# Altium schematic sheet Gate_Driver.SchDoc
size A2
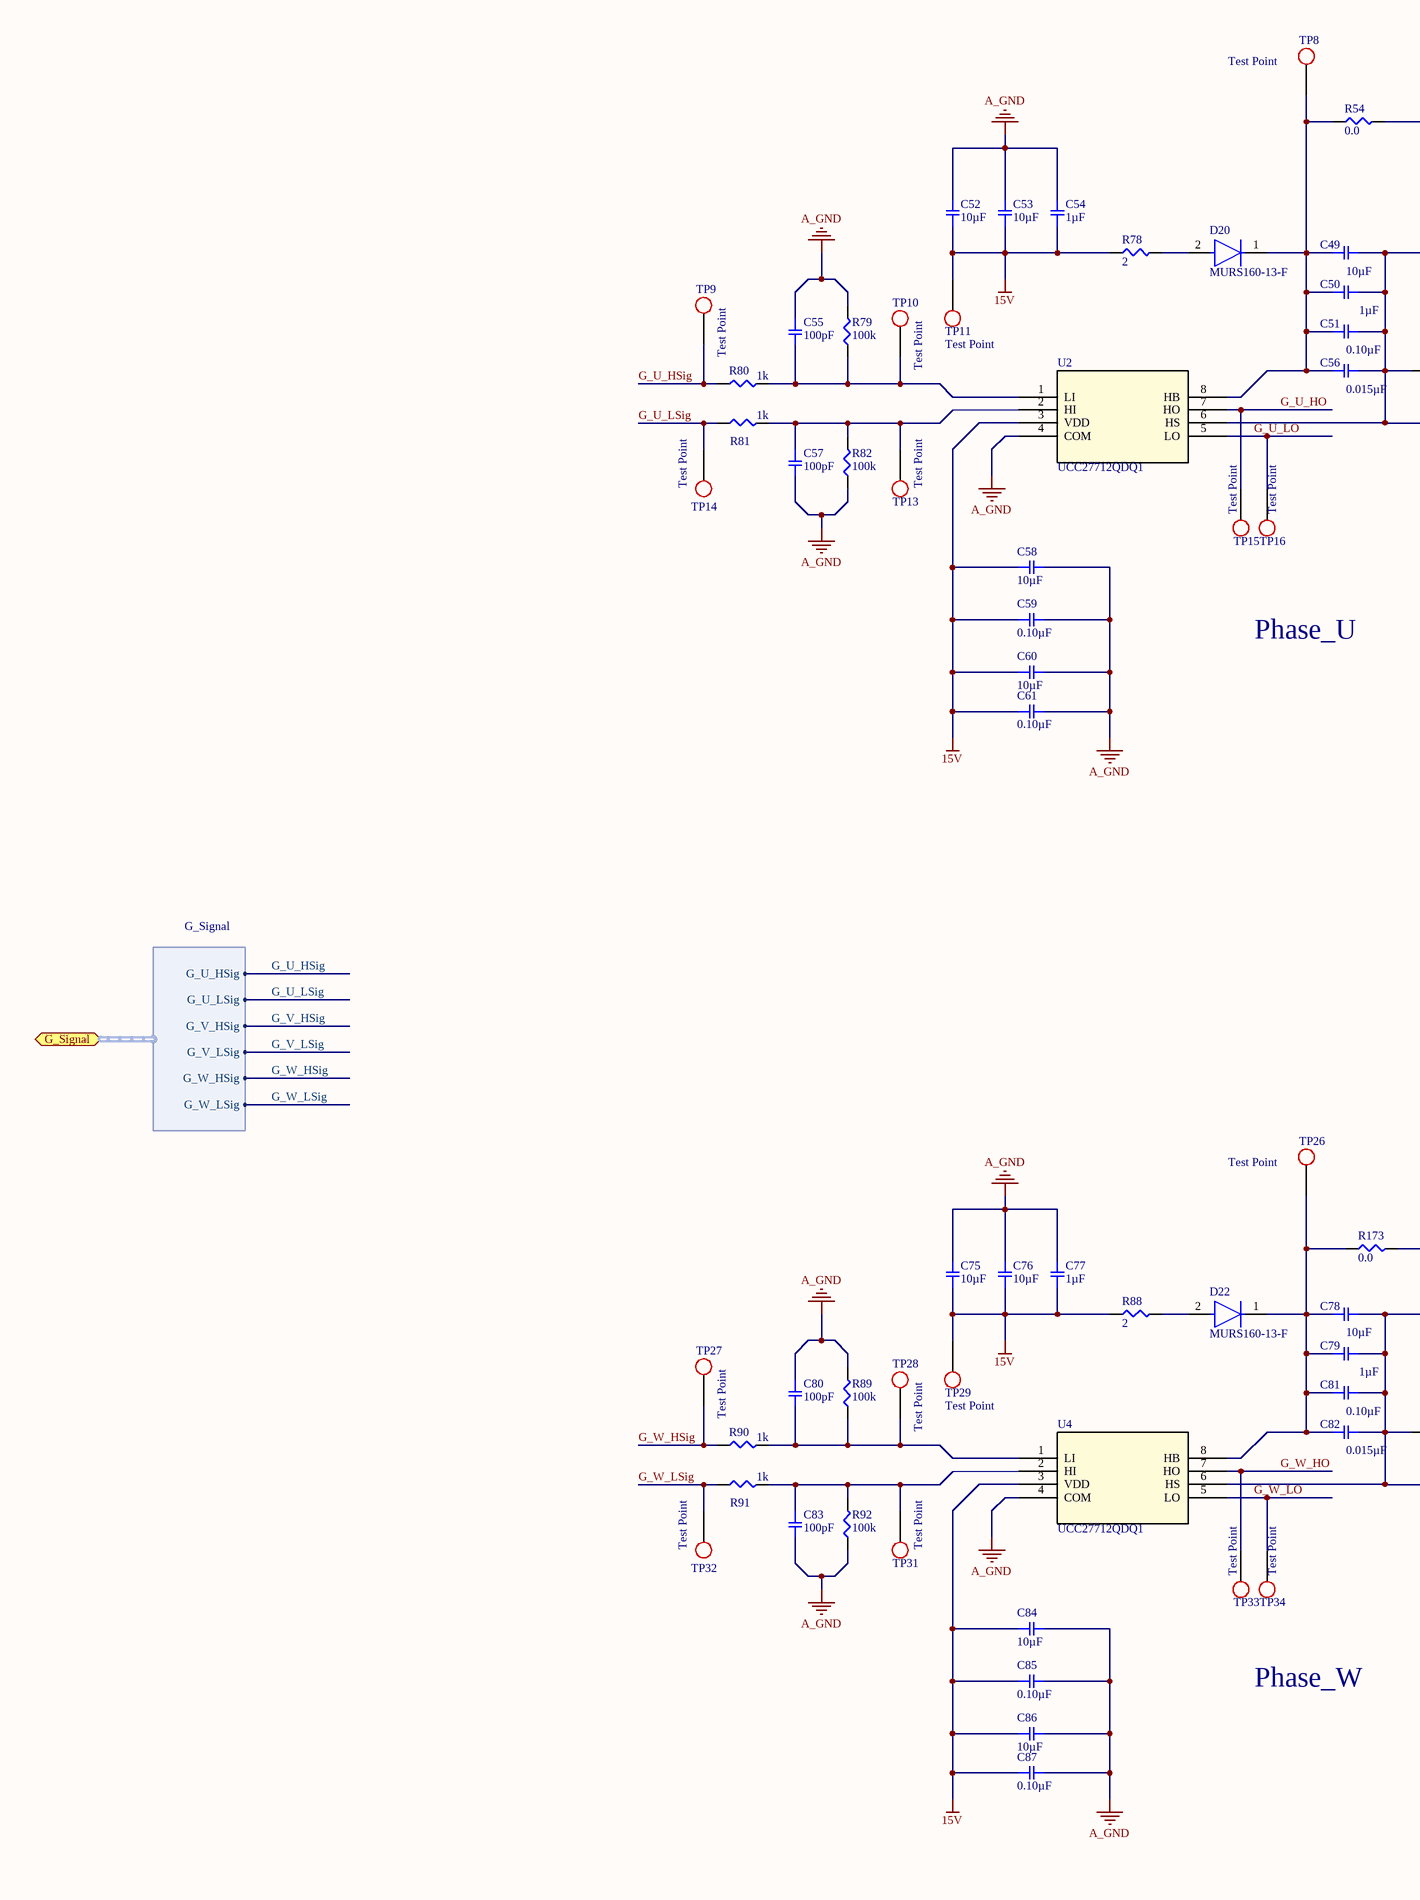
[diagram p0: Gate_Driver.SchDoc, left]
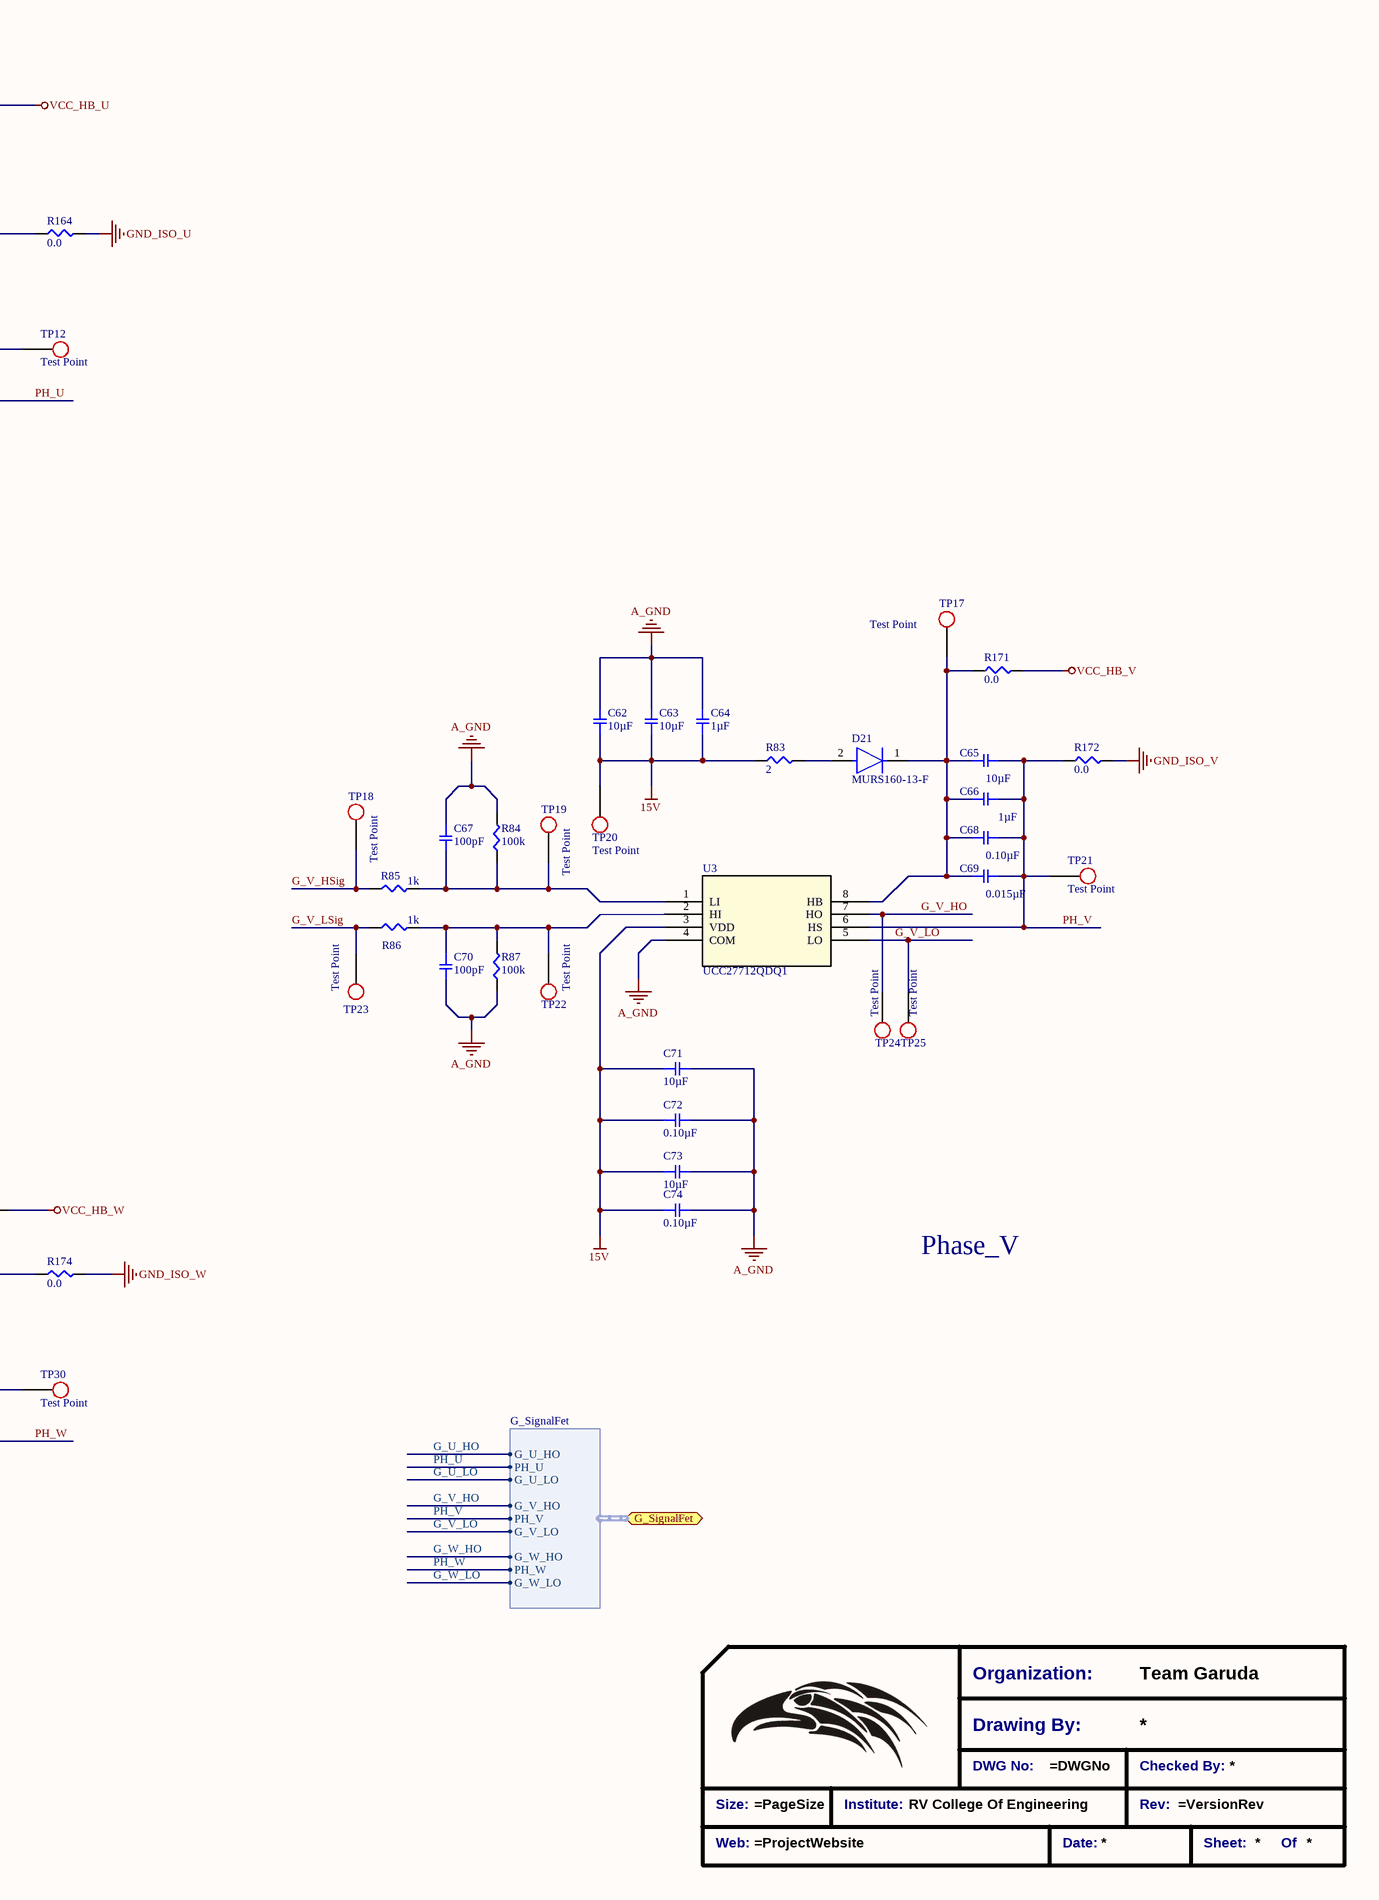
[diagram p1: Gate_Driver.SchDoc, right]

## Parts
*?  Title_Block  (value not drawn)  (graphical)
C49  10µF  [SMD-1206C]
C50  1µF  [SMD-0805C]
C51  0.10µF  [SMD-0805C]
C52  10µF  [SMD-1206C]
C53  10µF  [SMD-1206C]
C54  1µF  [SMD-0805C]
C55  100pF  [SMD-0805C]
C56  0.015µF  [SMD-0603C]
C57  100pF  [SMD-0805C]
C58  10µF  [SMD-1206C]
C59  0.10µF  [SMD-0805C]
C60  10µF  [SMD-1206C]
C61  0.10µF  [SMD-0805C]
C62  10µF  [SMD-1206C]
C63  10µF  [SMD-1206C]
C64  1µF  [SMD-0805C]
C65  10µF  [SMD-1206C]
C66  1µF  [SMD-0805C]
C67  100pF  [SMD-0805C]
C68  0.10µF  [SMD-0805C]
C69  0.015µF  [SMD-0603C]
C70  100pF  [SMD-0805C]
C71  10µF  [SMD-1206C]
C72  0.10µF  [SMD-0805C]
C73  10µF  [SMD-1206C]
C74  0.10µF  [SMD-0805C]
C75  10µF  [SMD-1206C]
C76  10µF  [SMD-1206C]
C77  1µF  [SMD-0805C]
C78  10µF  [SMD-1206C]
C79  1µF  [SMD-0805C]
C80  100pF  [SMD-0805C]
C81  0.10µF  [SMD-0805C]
C82  0.015µF  [SMD-0603C]
C83  100pF  [SMD-0805C]
C84  10µF  [SMD-1206C]
C85  0.10µF  [SMD-0805C]
C86  10µF  [SMD-1206C]
C87  0.10µF  [SMD-0805C]
D20  MURS160-13-F  [FP-SMB-MFG]
D21  MURS160-13-F  [FP-SMB-MFG]
D22  MURS160-13-F  [FP-SMB-MFG]
R54  0.0  [SMD-0805-RES]
R78  2  [SMD-0805-RES]
R79  100k  [SMD-0805-RES]
R80  1k  [SMD-0805-RES]
R81  1k  [SMD-0805-RES]
R82  100k  [SMD-0805-RES]
R83  2  [SMD-0805-RES]
R84  100k  [SMD-0805-RES]
R85  1k  [SMD-0805-RES]
R86  1k  [SMD-0805-RES]
R87  100k  [SMD-0805-RES]
R88  2  [SMD-0805-RES]
R89  100k  [SMD-0805-RES]
R90  1k  [SMD-0805-RES]
R91  1k  [SMD-0805-RES]
R92  100k  [SMD-0805-RES]
R164  0.0  [SMD-0805-RES]
R171  0.0  [SMD-0805-RES]
R172  0.0  [SMD-0805-RES]
R173  0.0  [SMD-0805-RES]
R174  0.0  [SMD-0805-RES]
TP8  Test Point  [Test_point_THT]  (no BOM)
TP9  Test Point  [Test_point_SMD]  (no BOM)
TP10  Test Point  [Test_point_SMD]  (no BOM)
TP11  Test Point  [Test_point_THT]  (no BOM)
TP12  Test Point  [Test_point_THT]  (no BOM)
TP13  Test Point  [Test_point_SMD]  (no BOM)
TP14  Test Point  [Test_point_SMD]  (no BOM)
TP15  Test Point  [Test_point_SMD]  (no BOM)
TP16  Test Point  [Test_point_SMD]  (no BOM)
TP17  Test Point  [Test_point_THT]  (no BOM)
TP18  Test Point  [Test_point_SMD]  (no BOM)
TP19  Test Point  [Test_point_SMD]  (no BOM)
TP20  Test Point  [Test_point_THT]  (no BOM)
TP21  Test Point  [Test_point_THT]  (no BOM)
TP22  Test Point  [Test_point_SMD]  (no BOM)
TP23  Test Point  [Test_point_SMD]  (no BOM)
TP24  Test Point  [Test_point_SMD]  (no BOM)
TP25  Test Point  [Test_point_SMD]  (no BOM)
TP26  Test Point  [Test_point_THT]  (no BOM)
TP27  Test Point  [Test_point_SMD]  (no BOM)
TP28  Test Point  [Test_point_SMD]  (no BOM)
TP29  Test Point  [Test_point_THT]  (no BOM)
TP30  Test Point  [Test_point_THT]  (no BOM)
TP31  Test Point  [Test_point_SMD]  (no BOM)
TP32  Test Point  [Test_point_SMD]  (no BOM)
TP33  Test Point  [Test_point_SMD]  (no BOM)
TP34  Test Point  [Test_point_SMD]  (no BOM)
U2  UCC27712QDQ1  [SOIC127P570X175_HS-9N]
U3  UCC27712QDQ1  [SOIC127P570X175_HS-9N]
U4  UCC27712QDQ1  [SOIC127P570X175_HS-9N]

## Ports
G_Signal (bidir, harness G_Signal), G_SignalFet (bidir, harness G_SignalFet)

## Harnesses
G_Signal: G_U_HSig, G_U_LSig, G_V_HSig, G_V_LSig, G_W_HSig, G_W_LSig
G_SignalFet: G_V_HO, PH_V, G_V_LO, PH_W, G_U_HO, PH_U, G_U_LO, G_W_HO, G_W_LO

## Nets
15V: C52.1 C53.1 C54.1 C58.1 C59.1 C60.1 C61.1 C62.1 C63.1 C64.1 C71.1 C72.1 C73.1 C74.1 C75.1 C76.1 C77.1 C84.1 C85.1 C86.1 C87.1 R78.1 R83.1 R88.1 TP11.1 TP20.1 TP29.1 U2.3(VDD) U3.3(VDD) U4.3(VDD)
A_GND: C52.2 C53.2 C54.2 C55.1 C57.2 C58.2 C59.2 C60.2 C61.2 C62.2 C63.2 C64.2 C67.1 C70.2 C71.2 C72.2 C73.2 C74.2 C75.2 C76.2 C77.2 C80.1 C83.2 C84.2 C85.2 C86.2 C87.2 R79.2 R82.1 R84.2 R87.1 R89.2 R92.1 U2.4(COM) U3.4(COM) U4.4(COM)
GND_ISO_U: R164.2
GND_ISO_V: R172.2
GND_ISO_W: R174.2
VCC_HB_U: R54.2
VCC_HB_V: R171.2
VCC_HB_W: R173.2
G_U_HO: TP15.1 U2.7(HO) ; port G_SignalFet.G_U_HO
G_U_HSig: R80.1 TP9.1 ; port G_Signal.G_U_HSig
G_U_LO: TP16.1 U2.5(LO) ; port G_SignalFet.G_U_LO
G_U_LSig: R81.1 TP14.1 ; port G_Signal.G_U_LSig
G_V_HO: TP24.1 U3.7(HO) ; port G_SignalFet.G_V_HO
G_V_HSig: R85.1 TP18.1 ; port G_Signal.G_V_HSig
G_V_LO: TP25.1 U3.5(LO) ; port G_SignalFet.G_V_LO
G_V_LSig: R86.1 TP23.1 ; port G_Signal.G_V_LSig
G_W_HO: TP33.1 U4.7(HO) ; port G_SignalFet.G_W_HO
G_W_HSig: R90.1 TP27.1 ; port G_Signal.G_W_HSig
G_W_LO: TP34.1 U4.5(LO) ; port G_SignalFet.G_W_LO
G_W_LSig: R91.1 TP32.1 ; port G_Signal.G_W_LSig
PH_U: C49.2 C50.2 C51.2 C56.2 R164.1 TP12.1 U2.6(HS) ; port G_SignalFet.PH_U
PH_V: C65.2 C66.2 C68.2 C69.2 R172.1 TP21.1 U3.6(HS) ; port G_SignalFet.PH_V
PH_W: C78.2 C79.2 C81.2 C82.2 R174.1 TP30.1 U4.6(HS) ; port G_SignalFet.PH_W
NetC49_1: C49.1 C50.1 C51.1 C56.1 D20.1(C) R54.1 TP8.1 U2.8(HB)
NetC55_2: C55.2 R79.1 R80.2 TP10.1 U2.1(LI)
NetC57_1: C57.1 R81.2 R82.2 TP13.1 U2.2(HI)
NetC65_1: C65.1 C66.1 C68.1 C69.1 D21.1(C) R171.1 TP17.1 U3.8(HB)
NetC67_2: C67.2 R84.1 R85.2 TP19.1 U3.1(LI)
NetC70_1: C70.1 R86.2 R87.2 TP22.1 U3.2(HI)
NetC78_1: C78.1 C79.1 C81.1 C82.1 D22.1(C) R173.1 TP26.1 U4.8(HB)
NetC80_2: C80.2 R89.1 R90.2 TP28.1 U4.1(LI)
NetC83_1: C83.1 R91.2 R92.2 TP31.1 U4.2(HI)
NetD20_2: D20.2(A) R78.2
NetD21_2: D21.2(A) R83.2
NetD22_2: D22.2(A) R88.2

## Notes on the sheet
- Phase_U
- Phase_V
- Phase_W
- (in symbol Title_Block) Organization:; Team Garuda; Drawing By:; DWG No:; Checked By:; Size:; Institute:; RV College Of Engineering; Rev:; Web:; Date:; Sheet:; Of

## Library data of the parts
*? = Title_Block: Standard Title Block
C49 C65 C78 = GRJ31CR71E106KE11L: CAP CER 10UF 25V X7R 1206; Manufacturer: Murata Electronics North America; Factory Stock: 0; Unit Price (USD): 0.69; Minimum Quantity: 1; Tolerance: ±10%; Datasheets: http://www.murata.com/~/media/webrenewal/support/library/catalog/products/capacitor/mlcc/c02e.pdf; Image: //media.digikey.com/Renders/Murata%20Renders/GR331BD72E473KW01L.jpg; Digi-Key Part Number: 490-10940-1-ND; Part Number: GRJ31CR71E106KE11L; Quantity Available: 1598; @ qty: 0; Packaging: Cut Tape (CT); Series: GRJ; Part Status: Active; Value: 10µF; Voltage: 25V; Temperature Coefficient: X7R; Operating Temperature: -55°C ~ 125°C; Features: Soft Termination; Ratings: -; Applications: Boardflex Sensitive; Mounting Type: Surface Mount, MLCC; Package / Case: 1206 (3216 Metric); Size / Dimension: 0.126" L x 0.063" W (3.20mm x 1.60mm); Height - Seated (Max): -; Thickness (Max): 0.075" (1.90mm); Lead Spacing: -; Lead Style: -
C50 C66 C79 = GCJ21BR71H105KA01L: CAP CER 1UF 50V X7R 0805; Manufacturer: Murata Electronics North America; Factory Stock: 0; Unit Price (USD): 0.33; Minimum Quantity: 1; Tolerance: ±10%; Datasheets: http://www.murata.com/~/media/webrenewal/support/library/catalog/products/capacitor/mlcc/c03e.ashx; Image: //media.digikey.com/Renders/Murata%20Renders/0805%20(2012%20Metric)%20.85mm.jpg; Digi-Key Part Number: 490-10667-1-ND; Part Number: GCJ21BR71H105KA01L; Quantity Available: 55137; @ qty: 0; Packaging: Cut Tape (CT); Series: GCJ; Part Status: Active; Value: 1µF; Voltage: 50V; Temperature Coefficient: X7R; Operating Temperature: -55°C ~ 125°C; Features: Soft Termination; Ratings: AEC-Q200; Applications: Automotive, Boardflex Sensitive; Mounting Type: Surface Mount, MLCC; Package / Case: 0805 (2012 Metric); Size / Dimension: 0.079" L x 0.049" W (2.00mm x 1.25mm); Height - Seated (Max): -; Thickness (Max): 0.057" (1.45mm); Lead Spacing: -; Lead Style: -
C51 C68 C81 = GRJ21BR71H104KE01L: CAP CER 0.1UF 50V X7R 0805; Manufacturer: Murata Electronics North America; Factory Stock: 0; Unit Price (USD): 0.19; Minimum Quantity: 1; Tolerance: ±10%; Datasheets: http://www.murata.com/~/media/webrenewal/support/library/catalog/products/capacitor/mlcc/c02e.pdf; Image: //media.digikey.com/Renders/Murata%20Renders/0805%20(2012%20Metric)%20.85mm.jpg; Digi-Key Part Number: 490-10923-1-ND; Part Number: GRJ21BR71H104KE01L; Quantity Available: 3070; @ qty: 0; Packaging: Cut Tape (CT); Series: GRJ; Part Status: Active; Value: 0.10µF; Voltage: 50V; Temperature Coefficient: X7R; Operating Temperature: -55°C ~ 125°C; Features: Soft Termination; Ratings: -; Applications: Boardflex Sensitive; Mounting Type: Surface Mount, MLCC; Package / Case: 0805 (2012 Metric); Size / Dimension: 0.079" L x 0.049" W (2.00mm x 1.25mm); Height - Seated (Max): -; Thickness (Max): 0.057" (1.45mm); Lead Spacing: -; Lead Style: -
C52 C53 C58 C60 C62 C63 C71 C73 C75 C76 C84 C86 = GRM31CR61H106KA12L: CAP CER 10UF 50V X5R 1206; Manufacturer: Murata Electronics North America; Factory Stock: 0; Unit Price (USD): 0.65; Minimum Quantity: 1; Tolerance: ±10%; Datasheets: http://www.murata.com/~/media/webrenewal/support/library/catalog/products/capacitor/mlcc/c02e.pdf; Image: //media.digikey.com/Renders/Murata%20Renders/GR331BD72E473KW01L.jpg; Digi-Key Part Number: 490-5961-1-ND; Part Number: GRM31CR61H106KA12L; Quantity Available: 86736; @ qty: 0; Packaging: Cut Tape (CT); Series: GRM; Part Status: Active; Value: 10µF; Voltage: 50V; Temperature Coefficient: X5R; Operating Temperature: -55°C ~ 85°C; Features: -; Ratings: -; Applications: General Purpose; Mounting Type: Surface Mount, MLCC; Package / Case: 1206 (3216 Metric); Size / Dimension: 0.126" L x 0.063" W (3.20mm x 1.60mm); Height - Seated (Max): -; Thickness (Max): 0.071" (1.80mm); Lead Spacing: -; Lead Style: -
C54 C64 C77 = GCJ219R71C105KA01D: CAP CER 1UF 16V X7R 0805; Manufacturer: Murata Electronics North America; Factory Stock: 0; Unit Price (USD): 0.29; Minimum Quantity: 1; Tolerance: ±10%; Datasheets: http://www.murata.com/~/media/webrenewal/support/library/catalog/products/capacitor/mlcc/c03e.ashx; Image: //media.digikey.com/Renders/Murata%20Renders/0805%20(2012%20Metric)%20.85mm.jpg; Digi-Key Part Number: 490-5800-1-ND; Part Number: GCJ219R71C105KA01D; Quantity Available: 140338; @ qty: 0; Packaging: Cut Tape (CT); Series: GCJ; Part Status: Active; Value: 1µF; Voltage: 16V; Temperature Coefficient: X7R; Operating Temperature: -55°C ~ 125°C; Features: Soft Termination; Ratings: AEC-Q200; Applications: Automotive, Boardflex Sensitive; Mounting Type: Surface Mount, MLCC; Package / Case: 0805 (2012 Metric); Size / Dimension: 0.079" L x 0.049" W (2.00mm x 1.25mm); Height - Seated (Max): -; Thickness (Max): 0.037" (0.95mm); Lead Spacing: -; Lead Style: -
C55 C57 C67 C70 C80 C83 = GCM2165C1H101JA16D: CAP CER 100PF 50V NP0 0805; Manufacturer: Murata Electronics North America; Factory Stock: 0; Unit Price (USD): 0.13; Minimum Quantity: 1; Tolerance: ±5%; Temperature Coefficient: C0G, NP0; Datasheets: http://www.murata.com/~/media/webrenewal/support/library/catalog/products/capacitor/mlcc/c03e.ashx; Image: //media.digikey.com/Renders/Murata%20Renders/0805%28GxM6%29.jpg; Digi-Key Part Number: 490-8031-1-ND; Part Number: GCM2165C1H101JA16D; Quantity Available: 42017; @ qty: 0; Packaging: Cut Tape (CT); Series: GCM; Part Status: Active; Value: 100pF; Voltage: 50V; Operating Temperature: -55°C ~ 125°C; Features: -; Ratings: AEC-Q200; Applications: Automotive; Mounting Type: Surface Mount, MLCC; Package / Case: 0805 (2012 Metric); Size / Dimension: 0.079" L x 0.049" W (2.00mm x 1.25mm); Height - Seated (Max): -; Thickness (Max): 0.028" (0.70mm); Lead Spacing: -; Lead Style: -
C56 C69 C82 = GCJ188R72A153KA01D: CAP CER 0.015UF 100V X7R 0603; Manufacturer: Murata Electronics North America; Factory Stock: 0; Unit Price (USD): 0.26; Minimum Quantity: 1; Tolerance: ±10%; Datasheets: http://www.murata.com/~/media/webrenewal/support/library/catalog/products/capacitor/mlcc/c03e.ashx; Image: //media.digikey.com/Renders/Murata%20Renders/0603%28LQG18%29.jpg; Digi-Key Part Number: 490-5770-1-ND; Part Number: GCJ188R72A153KA01D; Quantity Available: 450; @ qty: 0; Packaging: Cut Tape (CT); Series: GCJ; Part Status: Active; Value: 0.015µF; Voltage: 100V; Temperature Coefficient: X7R; Operating Temperature: -55°C ~ 125°C; Features: Soft Termination; Ratings: AEC-Q200; Applications: Automotive, Boardflex Sensitive; Mounting Type: Surface Mount, MLCC; Package / Case: 0603 (1608 Metric); Size / Dimension: 0.063" L x 0.031" W (1.60mm x 0.80mm); Height - Seated (Max): -; Thickness (Max): 0.031" (0.80mm); Lead Spacing: -; Lead Style: -
C59 C61 C72 C74 C85 C87 = GCM21BR71H104KA37K: CAP CER 0.1UF 50V X7R 0805; Manufacturer: Murata Electronics North America; Factory Stock: 0; Unit Price (USD): 0.12; Minimum Quantity: 1; Tolerance: ±10%; Datasheets: http://www.murata.com/~/media/webrenewal/support/library/catalog/products/capacitor/mlcc/c03e.ashx; Image: //media.digikey.com/photos/Murata%20Photos/NCP,GCM%20SERIES%200805.jpg; Digi-Key Part Number: 490-8049-1-ND; Part Number: GCM21BR71H104KA37K; Quantity Available: 322; @ qty: 0; Packaging: Cut Tape (CT); Series: GCM; Part Status: Active; Value: 0.10µF; Voltage: 50V; Temperature Coefficient: X7R; Operating Temperature: -55°C ~ 125°C; Features: -; Ratings: AEC-Q200; Applications: Automotive; Mounting Type: Surface Mount, MLCC; Package / Case: 0805 (2012 Metric); Size / Dimension: 0.079" L x 0.049" W (2.00mm x 1.25mm); Height - Seated (Max): -; Thickness (Max): 0.055" (1.40mm); Lead Spacing: -; Lead Style: -
D20-D22 = CMP-12791-000032-1: DIODE GEN PURP 600V 1A SMB; Manufacturer: Diodes Inc.; Standoff Height: 0.05mm; Max Surge Forward Current: 35A; Capacitance: 10pF; Peak Reverse Current: 5uA; Max Junction Temp: +150°C; Value: 10pF; Reverse Voltage: 600V; Device Class L1: Discrete Semiconductors; Lead Free: Yes; Temperature Range Low: -55°C; Mouser Description: Rectifier Super-Fast Recovery Gpp Smb 1.0A 600V Rohs 3K Rohs Compliant: Yes; Temperature: -55°C to +150°C; Category: Diode; Digikey Description: DIODE GEN PURP 600V 1A SMB; Height: 2.5mm; Manufacturer Part Number: MURS160-13-F; RoHS: TRUE; ComponentLink2Description: Datasheet; Octopart: https://octopart.com/murs160-13-f-diodes+inc.-332437; ComponentLink2URL: https://www.diodes.com/assets/Datasheets/ds30130.pdf; Automotive: No; Max Repetitive Reverse Voltage: 600V; Footprint Url: https://www.diodes.com/assets/Package-Files/SMB.pdf; Device Class L3: Rectifier Diodes; Temperature Range High: +150°C; Device Class L2: Diodes; Package: SMB; Forward Current: 1A
R54 R164 R171-R174 = ERJ-6GEY0R00V: RES SMD 0.0 OHM JUMPER 1/8W 0805; Manufacturer: Panasonic Electronic Components; Factory Stock: 0; Unit Price (USD): 0.00544; @ qty: 1500; Minimum Quantity: 1; Power (Watts): 0.125W, 1/8W; Part Number: ERJ-6GEY0R00V; Datasheets: http://industrial.panasonic.com/www-cgi/jvcr13pz.cgi?E+PZ+3+AOA0001+ERJ6GEY0R00V+7+WW; Image: //media.digikey.com/Renders/Panasonic%20Renders/ERJ-0805%20Pkg.jpg; Digi-Key Part Number: P0.0ACT-ND; Quantity Available: 1597627; Packaging: Cut Tape (CT); Series: ERJ; Part Status: Active; Value: 0.0; Tolerance: Jumper; Composition: Thick Film; Features: Automotive AEC-Q200; Temperature Coefficient: -; Operating Temperature: -55°C ~ 155°C; Package / Case: 0805 (2012 Metric); Supplier Device Package: 0805; Size / Dimension: 0.079" L x 0.049" W (2.00mm x 1.25mm); Height - Seated (Max): 0.028" (0.70mm); Number of Terminations: 2; Failure Rate: -
R78 R83 R88 = ERJ-6BQF2R0V: RES SMD 2 OHM 1% 1/3W 0805; Manufacturer: Panasonic Electronic Components; Factory Stock: 0; Unit Price (USD): 0.05834; @ qty: 1500; Minimum Quantity: 1; Power (Watts): 0.333W, 1/3W; Temperature Coefficient: ±200ppm/°C; Part Number: ERJ-6BQF2R0V; Datasheets: https://industrial.panasonic.com/cdbs/www-data/pdf/RDA0000/AOA0000C239.pdf; Image: //media.digikey.com/Renders/Panasonic%20Renders/ERJ-0805%20Pkg.jpg; Digi-Key Part Number: P17503CT-ND; Quantity Available: 4729; Packaging: Cut Tape (CT); Series: ERJ; Part Status: Active; Value: 2; Tolerance: ±1%; Composition: Thick Film; Features: Automotive AEC-Q200, Current Sense; Operating Temperature: -55°C ~ 125°C; Package / Case: 0805 (2012 Metric); Supplier Device Package: 0805; Size / Dimension: 0.079" L x 0.049" W (2.00mm x 1.25mm); Height - Seated (Max): 0.028" (0.70mm); Number of Terminations: 2; Failure Rate: -
R79 R82 R84 R87 R89 R92 = ERJ-6ENF1003V: RES SMD 100K OHM 1% 1/8W 0805; Manufacturer: Panasonic Electronic Components; Factory Stock: 0; Unit Price (USD): 0.00729; @ qty: 1500; Minimum Quantity: 1; Power (Watts): 0.125W, 1/8W; Temperature Coefficient: ±100ppm/°C; Part Number: ERJ-6ENF1003V; Datasheets: http://industrial.panasonic.com/www-cgi/jvcr13pz.cgi?E+PZ+3+AOA0002+ERJ6ENF1003V+7+WW; Image: //media.digikey.com/Renders/Panasonic%20Renders/ERJ-0805%20Pkg.jpg; Digi-Key Part Number: P100KCCT-ND; Quantity Available: 760677; Packaging: Cut Tape (CT); Series: ERJ; Part Status: Active; Value: 100k; Tolerance: ±1%; Composition: Thick Film; Features: Automotive AEC-Q200; Operating Temperature: -55°C ~ 155°C; Package / Case: 0805 (2012 Metric); Supplier Device Package: 0805; Size / Dimension: 0.079" L x 0.049" W (2.00mm x 1.25mm); Height - Seated (Max): 0.028" (0.70mm); Number of Terminations: 2; Failure Rate: -
R80 R81 R85 R86 R90 R91 = ERJ-6GEYJ102V: RES SMD 1K OHM 5% 1/8W 0805; Manufacturer: Panasonic Electronic Components; Factory Stock: 0; Unit Price (USD): 0.00496; @ qty: 1500; Minimum Quantity: 1; Power (Watts): 0.125W, 1/8W; Temperature Coefficient: ±200ppm/°C; Part Number: ERJ-6GEYJ102V; Datasheets: http://industrial.panasonic.com/www-cgi/jvcr13pz.cgi?E+PZ+3+AOA0001+ERJ6GEYJ102V+7+WW; Image: //media.digikey.com/Renders/Panasonic%20Renders/ERJ-0805%20Pkg.jpg; Digi-Key Part Number: P1.0KACT-ND; Quantity Available: 1082417; Packaging: Cut Tape (CT); Series: ERJ; Part Status: Active; Value: 1k; Tolerance: ±5%; Composition: Thick Film; Features: Automotive AEC-Q200; Operating Temperature: -55°C ~ 155°C; Package / Case: 0805 (2012 Metric); Supplier Device Package: 0805; Size / Dimension: 0.079" L x 0.049" W (2.00mm x 1.25mm); Height - Seated (Max): 0.028" (0.70mm); Number of Terminations: 2; Failure Rate: -
U2-U4 = UCC27712QDQ1: No Description Available; Vendor: Texas Instruments; Built_By: EMA_Molly; SourceLibrary: TI_2019-05-11; Manufacturer_Part_Number: UCC27712QDQ1; Copyright: Copyright (C) 2018 Accelerated Designs. All rights reserved; RefDes: RefDes; Type: DEV